# Altium project Sensor_Box_GPRS.PrjPCB
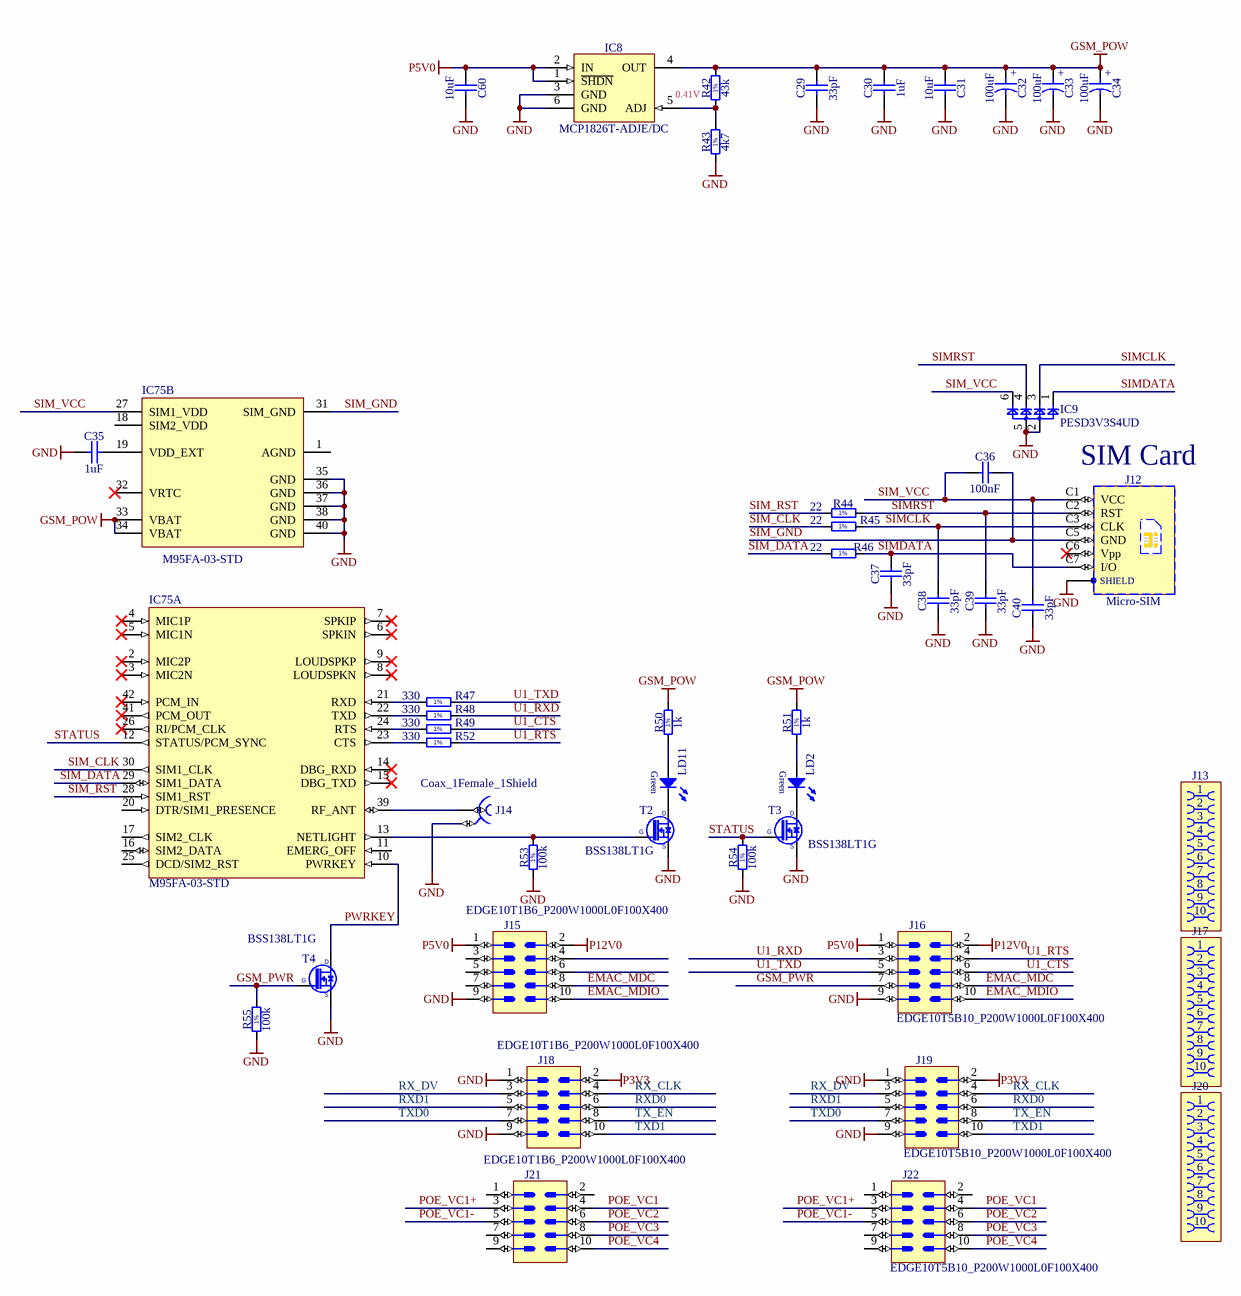
[diagram p0: Sensor_Box_GPRS.SchDoc]
1 sheet, 46 parts. Net scope: global (net labels, ports and power ports of the same name join across sheets).
Board file: Sensor_Box_GPRS.PCBDOC

## Sheet Sensor_Box_GPRS.SchDoc: Title
size 420 x 297 mm; Author: G.Kasprowicz; CompanyName: WUT ISE; DrawnBy: G.Kasprowicz; Organization: WUT ISE; Address1: PW ISE; Address2: Nowowiejska 15/19 00-665 Warsaw; Address3: gkasprow@gmail.com; Revision: 1.0; SheetNumber: -; SheetTotal: -; ModifiedBy: -; CheckedDate: -; Title2: Title2; DivGrp: WUT ISE; Designer: G.Kasprowicz; ModifiedDate: -; ProjectName: Sensor Box

### Parts
C29  33pF  [CAPC1005X55N]
C30  1uF  [CAPC1005X55N]
C31  10uF  [CAPC2012X135N]
C32  100uF  [CAPAE660X540N]
C33  100uF  [CAPAE660X540N]
C34  100uF  [CAPAE660X540N]
C35  1uF  [CAPC1005X55N]
C36  100nF  [CAPC1005X55N]
C37  33pF  [CAPC1005X55N]
C38  33pF  [CAPC1005X55N]
C39  33pF  [CAPC1005X55N]
C40  33pF  [CAPC1005X55N]
C60  10uF  [CAPC2012X135N]
IC8  MCP1826T-ADJE/DC  [SOT127P700X180-6N]
IC9  PESD3V3S4UD  [SOT457]
IC75  M95FA-03-STD  [QUEC-M95FA-03-STD_V]  (parts A,B of 2)
J12  Micro-SIM  [MOLEX_78800-0001]
J13  (no value)  [AVX_00 9159 010 061 916]
J14  Coax_1Female_1Shield  [NINIGI_MMCX-10]
J15  (no value)  [EDGE10T1B6_P200W1000L0F100X400]
J16  (no value)  [EDGE10T5B10_P200W1000L0F100X400]
J17  (no value)  [AVX_00 9159 010 061 916]
J18  (no value)  [EDGE10T1B6_P200W1000L0F100X400]
J19  (no value)  [EDGE10T5B10_P200W1000L0F100X400]
J20  (no value)  [AVX_00 9159 010 061 916]
J21  (no value)  [EDGE10T1B6_P200W1000L0F100X400]
J22  (no value)  [EDGE10T5B10_P200W1000L0F100X400]
LD2  Green  [LED_KINGBRIGHT_KPTR3216]  (value not drawn)
LD11  Green  [LED_KINGBRIGHT_KPTR3216]  (value not drawn)
R42  43k  [RESC1608X55N]
R43  4k7  [RESC1005X40N]
R44  22  [RESC1005X40N]
R45  22  [RESC1005X40N]
R46  22  [RESC1005X40N]
R47  330  [RESC1005X40N]
R48  330  [RESC1005X40N]
R49  330  [RESC1005X40N]
R50  1k  [RESC1005X40N]
R51  1k  [RESC1005X40N]
R52  330  [RESC1005X40N]
R53  100k  [RESC1005X40N]
R54  100k  [RESC1005X40N]
R55  100k  [RESC1005X40N]
T2  BSS138LT1G  [SOT95P240X110-3N]
T3  BSS138LT1G  [SOT95P240X110-3N]
T4  BSS138LT1G  [SOT95P240X110-3N]

### Nets
GND: C29.1 C30.1 C31.2 C32.2 C33.2 C34.2 C35.1 C37.1 C38.1 C39.1 C40.1 C60.2 IC8.3(GND) IC8.6(GND) IC9.2 IC9.5 IC75.35(GND) IC75.36(GND) IC75.37(GND) IC75.38(GND) IC75.40(GND) J12.SHIELD J14.2 J15.9 J16.9 J18.1 J18.9 J19.1 J19.9 R43.1 R53.1 R54.1 R55.1 T2.2(S) T3.2(S) T4.2(S)
GSM_POW: C29.2 C30.2 C31.1 C32.1 C33.1 C34.1 IC8.4(OUT) IC75.33(VBAT) IC75.34(VBAT) R42.2 R50.2 R51.2
P3V3: J18.2 J19.2
P5V0: C60.1 IC8.1(~{SHDN}) IC8.2(IN) J15.1 J16.1
P12V0: J15.2 J16.2
EMAC_MDC: J15.8 J16.8
EMAC_MDIO: J15.10 J16.10
GSM_PWR: J16.7 R55.2 T4.1(G)
POE_VC1: J21.4 J22.4
POE_VC1+: J21.3 J22.3
POE_VC1-: J21.5 J22.5
POE_VC2: J21.6 J22.6
POE_VC3: J21.8 J22.8
POE_VC4: J21.10 J22.10
PWRKEY: IC75.10(PWRKEY) T4.3(D)
RX_CLK: J18.4 J19.4
RX_DV: J18.3 J19.3
RXD0: J18.6 J19.6
RXD1: J18.5 J19.5
SIM_CLK: IC75.30(SIM1_CLK) R45.1
SIM_DATA: IC75.29(SIM1_DATA) R46.1
SIM_GND: C36.2 IC75.31(SIM_GND) J12.C5(GND)
SIM_RST: IC75.28(SIM1_RST) R44.1
SIM_VCC: C36.1 C40.2 IC9.6 IC75.27(SIM1_VDD) J12.C1(VCC)
SIMCLK: C38.2 IC9.3 J12.C3(CLK) R45.2
SIMDATA: C37.2 IC9.1 J12.C7(I/O) R46.2
SIMRST: C39.2 IC9.4 J12.C2(RST) R44.2
STATUS: IC75.12(STATUS/PCM_SYNC) R54.2 T3.1(G)
TX_EN: J18.8 J19.8
TXD0: J18.7 J19.7
TXD1: J18.10 J19.10
U1_CTS: J16.6 R49.2
U1_RTS: J16.4 R52.2
U1_RXD: J16.3 R48.2
U1_TXD: J16.5 R47.2
NetC35_2: C35.2 IC75.19(VDD_EXT)
NetIC8_5: IC8.5(ADJ) R42.1 R43.2
NetIC75_13: IC75.13(NETLIGHT) R53.2 T2.1(G)
NetIC75_21: IC75.21(RXD) R47.1
NetIC75_22: IC75.22(TXD) R48.1
NetIC75_23: IC75.23(CTS) R52.1
NetIC75_24: IC75.24(RTS) R49.1
NetIC75_39: IC75.39(RF_ANT) J14.1
NetLD2_1: LD2.1(C) T3.3(D)
NetLD2_2: LD2.2(A) R51.1
NetLD11_1: LD11.1(C) T2.3(D)
NetLD11_2: LD11.2(A) R50.1

Not connected (* = marked no-connect by the designer): IC75 1(AGND) 2(MIC2P)* 3(MIC2N)* 4(MIC1P)* 5(MIC1N)* 6(SPKIN)* 7(SPKIP)* 8(LOUDSPKN)* 9(LOUDSPKP)* 11(EMERG_OFF) 14(DBG_RXD)* 15(DBG_TXD)* 16(SIM2_DATA) 17(SIM2_CLK) 18(SIM2_VDD) 20(DTR/SIM1_PRESENCE) 25(DCD/SIM2_RST) 26(RI/PCM_CLK)* 32(VRTC)* 41(PCM_OUT)* 42(PCM_IN)*; J12 C6(Vpp)*; J15 3 4 5 6 7; J21 1 2 7 9; J22 1 2 7 9

### Notes on the sheet
- 0.41V
- SIM Card
- Project/Equipment
- Document
- Designer
- Drawn by
- Check.by
- Copyright WUT ISE 2018.
  This documentation describes Open Hardware and is licensed under the CERN OHL v.1.1. You may redistribute and modify this documentation under the terms of the CERN OHL v.1.1. (http://ohwr.org/CERNOHL). This documentation is distributed WITHOUT ANY EXPRESS OR IMPLIED WARRANTY, INCLUDING OF MERCHANTABILITY, SATISFACTORY QUALITY AND FITNESS FOR A PARTICULAR PURPOSE. Please see the CERN OHL v.1.1 for applicable conditions.
- Contact
- File
- Last Mod.
- Print Date
- Sheet
- Size
- A3
- of
- Rev
- (in symbol CAE660-540_100UF_16V_20%) +
- (in symbol R0402_1K_1%_0.0625W_100PPM) 1%
- (in symbol R0402_4K7_1%_0.0625W_100PPM) 1%
- (in symbol R0402_22R_1%_0.0625W_100PPM) 1%
- (in symbol R0402_100K_1%_0.0625W_100PPM) 1%
- (in symbol R0402_330R_1%_0.0625W_100PPM) 1%
- (in symbol R0603_43K_1%_0.1W_100PPM) 1%

### Library data of the parts
C29 C37-C40 = CC0402_33PF_50V_5%_C0G: Non-polarised capacitor; Part Description: SMD Multilayer Chip Ceramic Capacitor; Manufacturer: GENERIC; Manufacturer1 Part Number: C0402C330J5GACTU; Voltage: 50V; TC: C0G/NP0; Tolerance: ±5%; Part Number: CC0402_33PF_50V_5%_C0G; Component Kind: Standard; Component Type: Standard; Pin Count: 2; Value: 33pF; Status: Preferred; Manufacturer Part Number: CC0402_33PF_50V_5%_C0G; Case: 0402; Mounted: Yes; Socket: No; SMD: Yes; Sense: No; Manufacturer1 Example: KEMET; Manufacturer1 ComponentHeight: 0.55mm; HelpURL: \\cern.ch\dfs\Applications\Altium\Datasheets\CC0805_C0G_KEMET_(Commercial Grade).pdf; Author: CERN DEM JLC; CreateDate: 03.12.2007; LatestRevisionDate: 22.04.2015
C30 C35 = CC0402_1UF_16V_10%_X5R: Non-polarised capacitor; Part Description: SMD Multilayer Chip Ceramic Capacitor; Manufacturer: GENERIC; Manufacturer1 Part Number: C1005X5R1C105KT; Voltage: 16V; TC: X5R; Tolerance: ±10%; Part Number: CC0402_1UF_16V_10%_X5R; Component Kind: Standard; Component Type: Standard; Pin Count: 2; Value: 1uF; Status: Preferred; Manufacturer Part Number: CC0402_1UF_16V_10%_X5R; Case: 0402; Mounted: Yes; Socket: No; SMD: Yes; Sense: No; Manufacturer1 Example: TDK; Manufacturer1 ComponentHeight: 0.55mm; HelpURL: \\cern.ch\dfs\Applications\Altium\Datasheets\CC0402_X5R_TDK_C.pdf; Author: CERN DEM JLC; CreateDate: 25.10.2012; LatestRevisionDate: 25.10.2012
C31 C60 = CC0805_10UF_16V_10%_X5R: Non-polarised capacitor; Part Description: SMD Multilayer Chip Ceramic Capacitor; Manufacturer: GENERIC; Manufacturer1 Part Number: C0805C106K4PAC; Voltage: 16V; TC: X5R; Tolerance: ±10%; Part Number: CC0805_10UF_16V_10%_X5R; Component Kind: Standard; Component Type: Standard; Pin Count: 2; Value: 10uF; Status: Preferred; Manufacturer Part Number: CC0805_10UF_16V_10%_X5R; Case: 0805; Mounted: Yes; Socket: No; SMD: Yes; Manufacturer1 Example: KEMET; Manufacturer1 ComponentHeight: 1.4mm; HelpURL: \\cern.ch\dfs\Applications\Altium\Datasheets\CC1206_X5R_KEMET.pdf; Author: CERN DEM JLC; CreateDate: 03.12.2007; LatestRevisionDate: 03.12.2007; Sense: No
C32-C34 = CAE660-540_100UF_16V_20%: Polarised capacitor; Part Description: Aluminum Electrolytic SMT Capacitor; Manufacturer: PANASONIC; Manufacturer Part Number: EEEFK1C101AP; Voltage: 16V; Tolerance: ±20%; Part Number: CAE660-540_100UF_16V_20%; Component Kind: Standard; Component Type: Standard; Pin Count: 2; Value: 100uF; Status: Not Recommended; Case: D; Mounted: Yes; Socket: No; SMD: Yes; Sense: No; ComponentHeight: 5.8mm; HelpURL: \\cern.ch\dfs\Applications\Altium\Datasheets\CAE_PANASONIC_FK.pdf; Author: CERN DEM JLC; CreateDate: 03.12.2007; LatestRevisionDate: 05.11.2014
C36 = CC0402_100NF_16V_10%_X7R: Non-polarised capacitor; Part Description: SMD Multilayer Chip Ceramic Capacitor; Manufacturer: GENERIC; Manufacturer1 Part Number: GRM155R71C104KA88D; Voltage: 16V; TC: X7R; Tolerance: ±10%; Part Number: CC0402_100NF_16V_10%_X7R; Component Kind: Standard; Component Type: Standard; Pin Count: 2; Value: 100nF; Status: Not Recommended; Manufacturer Part Number: CC0402_100NF_16V_10%_X7R; Case: 0402; Mounted: Yes; Socket: No; SMD: Yes; Manufacturer1 Example: MURATA; Manufacturer1 ComponentHeight: 0.55mm; HelpURL: \\cern.ch\dfs\Applications\Altium\Datasheets\CC0402_X7R_MURATA_GRM.pdf; Author: CERN DEM JLC; CreateDate: 05.12.2013; LatestRevisionDate: 03.12.2007; Sense: No
IC8 = MCP1826T-ADJE/DC: 0.8V to 5.0V, 1A Low Voltage, Low Quiescent Current, Adjustable Positive LDO Regulator; Manufacturer: MICROCHIP TECHNOLOGY; PressFit: No; Bonding: No; Part Number: MCP1826T-ADJE/DC; Component Kind: Standard; Component Type: Standard; Device: MCP1826T-ADJE/DC; PackageDescription: SOT223, 6-Leads, Body 6.6x7.3mm (max), Pitch 1.27mm, IPC Medium Density; Part Description: 0.8V to 5.0V, 1A Low Voltage, Low Quiescent Current, Adjustable Positive LDO Regulator; Manufacturer Part Number: MCP1826T-ADJE/DC; Pin Count: 6; Case: SOT223; Mounted: Yes; Socket: No; SMD: Yes; Sense: No; ComponentHeight: 1.8mm; HelpURL: \\cern.ch\dfs\Applications\Altium\Datasheets\MCP1826T-ADJE-DC.pdf; Author: CERN DEM JLC; CreateDate: 03.10.2012; LatestRevisionDate: 03.10.2012
IC9 = D_TVS_PESD3V3S4UD: 3.3V TVS
IC75 = CMP-2000-06650-1: Quad-Band GSM / GPRS Module, 850 / 900 / 1800 / 1900 MHz, 3.3 to 4.6 V, -40 to 85 degC, 42-Pin SMD, RoHS, Tape and Reel; Manufacturer: QUECTELWIRELESSSOLUTIONS; Manufacturer URL: http://www.quectel.com/; Datasheet Version: Rev. 3.1, 11/2014; Package Reference: M95FA-03-STD; Package Description: 42-Pin Sourface Mount Device, Body 23.6 x 19.9 mm; Package: 42LCC; Category: RFModulesMisc; Mounting Technology: SurfaceMount; Operating Temperature: -40to85°C; Datasheet URL: https://www.codico.com/shop/media/datasheets/Quectel_M95_Hardware_Design_V3.1.pdf
J12 = MOLEX_78800-0001: 6 Contacts + Shield SIM Connector; Part Description: 1.50mm Height Hinged-style micro-SIM Card Socket Without Detect Switch, Surface Mount, 6 Circuits, Low-Halogen, Lead-Free; Manufacturer: MOLEX; PressFit: No; Part Number: MOLEX_78800-0001; Component Kind: Standard; Component Type: Standard; Pin Count: 6; Family: Micro-SIM; Mounted: Yes; Socket: No; SMD: Yes; Sense: No; Status: None; Manufacturer Part Number: 78800-0001; ComponentHeight: 1.6mm; HelpURL: \\cern.ch\dfs\Applications\Altium\Datasheets\MOLEX_78800-0001.pdf; Author: CERN DEM MR; CreateDate: 30.01.2018; LatestRevisionDate: 30.01.2018
J13 J17 J20 = AVX_00 9159 010 061 916: Open Ended Card Edge Connector, 9159 Series; Part Description: 10 Contacts, 2mm Pitch, Open Ended Card Edge Connector, 9159 Series; Manufacturer: AVX; PressFit: No; Part Number: AVX_00 9159 010 061 916; Component Kind: Standard; Component Type: Standard; Pin Count: 10; Mounted: Yes; Socket: No; SMD: No; Sense: No; Status: None; Manufacturer Part Number: 00 9159 010 061 916; ComponentHeight: 1.6mm; HelpURL: \\cern.ch\dfs\Applications\Altium\Datasheets\AVX_00 9159 010 061 916.pdf; Author: CERN DEM MR; CreateDate: 13.02.2018; LatestRevisionDate: 13.02.2018
J14 = CON_RF_MMCX: Part Number: MMCX-10; Part Description: Straight Through-hole 50 Ohm Micro Mini RF Jack, MMCX Series; Manufacturer: NINIGI; Manufacturer Part Number: NINIGI MMCX-10; PressFit: No; Component Kind: Standard; Component Type: Standard; Pin Count: 2; Mounted: Yes; Socket: No; Sense: No; SMD: No; Status: None; ComponentHeight: 4.35mm; HelpURL: \\cern.ch\dfs\Applications\Altium\Datasheets\SAMTEC_MMCX-J-P-H-ST-TH1.pdf; Author: GK; CreateDate: 05.12.2012; LatestRevisionDate: 05.12.2012
J15 J18 J21 = EDGE10T1B6_P200W1000L0F100X400: PCB Edge Connector 10 (2x5); Part Description: 10 Contacts Board Edge Connector, Pitch 2mm, Length 0mm, Width 10mm, Finger Lenght 4mm, Finger Width 1mm; Mounted: No; PressFit: No; Part Number: EDGE10T1B6_P200W1000L0F100X400; Component Kind: Standard (No BOM); Component Type: Standard (No BOM); Pin Count: 10; Socket: No; SMD: No; Sense: No; Status: None; ComponentHeight: 0mm; HelpURL: \\cern.ch\dfs\Applications\Altium\Datasheets\EDGE10T1B6_P200W1000L0F100X400.pdf; Author: CERN DEM MR; CreateDate: 14.02.2018; LatestRevisionDate: 14.02.2018
J16 J19 J22 = EDGE10T5B10_P200W1000L0F100X400: PCB Edge Connector 10 (2x5); Part Description: 10 Contacts Board Edge Connector, Pitch 2mm, Length 0mm, Width 10mm, Finger Lenght 4mm, Finger Width 1mm; Mounted: No; PressFit: No; Part Number: EDGE10T5B10_P200W1000L0F100X400; Component Kind: Standard (No BOM); Component Type: Standard (No BOM); Pin Count: 10; Socket: No; SMD: No; Sense: No; Status: None; ComponentHeight: 0mm; HelpURL: \\cern.ch\dfs\Applications\Altium\Datasheets\EDGE10T5B10_P200W1000L0F100X400.pdf; Author: CERN DEM MR; CreateDate: 14.02.2018; LatestRevisionDate: 14.02.2018
LD2 LD11 = LED_KINGBRIGHT_KPTR-3216CGCK: LED Green 1A 2C; Part Description: Reverse Mount LED 1.4x1.6mm Green; PressFit: No; Bonding: No; Part Number: LED_KINGBRIGHT_KPTR-3216CGCK; Component Kind: Standard; Component Type: Standard; Color: Green; PackageDescription: Reverse Mount LED 3216, Hole 2.1x2.3mm 0.35mm Height; Manufacturer: KINGBRIGHT; Manufacturer Part Number: KPTR-3216CGCK; Pin Count: 2; Mounted: Yes; Socket: No; SMD: Yes; Sense: No; ComponentHeight: 0.35mm; HelpURL: \\cern.ch\dfs\Applications\Altium\Datasheets\LED_KINGBRIGHT_KPTR-3216CGCK.pdf; Author: CERN DEM MR; CreateDate: 15.02.2016; LatestRevisionDate: 15.02.2016
R42 = R0603_43K_1%_0.1W_100PPM: Resistor - 1%; Part Description: General Purpose Thick Film Chip Resistor; Manufacturer: GENERIC; Manufacturer1 Part Number: NRC06F4302TRF; Power: 0.1W; TC: ±100ppm/°C; PressFit: No; Part Number: R0603_43K_1%_0.1W_100PPM; Component Kind: Standard; Component Type: Standard; Pin Count: 2; Value: 43k; Status: Preferred; Tolerance: ±1%; Manufacturer Part Number: R0603_43K_1%_0.1W_100PPM; Case: 0603; Mounted: Yes; Sense: No; Socket: No; SMD: Yes; Manufacturer1 Example: NIC COMPONENT; Manufacturer1 ComponentHeight: 0.55mm; HelpURL: \\cern.ch\dfs\Applications\Altium\Datasheets\R0603_NIC_NRC.pdf; Author: CERN DEM JLC; CreateDate: 03.12.2007; LatestRevisionDate: 13.03.2008
R43 = R0402_4K7_1%_0.0625W_100PPM: Resistor - 1%; Part Description: General Purpose Thick Film Chip Resistor; Manufacturer: GENERIC; Manufacturer1 Part Number: 232270674702L; TC: ±100ppm/°C; PressFit: No; Part Number: R0402_4K7_1%_0.0625W_100PPM; Component Kind: Standard; Component Type: Standard; Pin Count: 2; Value: 4k7; Status: Not Recommended; Power: 0.0625W; Tolerance: ±1%; Manufacturer Part Number: R0402_4K7_1%_0.0625W_100PPM; Case: 0402; Mounted: Yes; Sense: No; Socket: No; SMD: Yes; Manufacturer1 Example: YAGEO PHYCOMP; Manufacturer1 ComponentHeight: 0.4mm; HelpURL: \\cern.ch\dfs\Applications\Altium\Datasheets\R0402_Phycomp_RC0402.pdf; Author: CERN DEM JLC; CreateDate: 03.12.2007; LatestRevisionDate: 17.10.2012
R44-R46 = R0402_22R_1%_0.0625W_100PPM: Resistor - 1%; Part Description: General Purpose Thick Film Chip Resistor; Manufacturer: GENERIC; Manufacturer1 Part Number: 232270672209L; TC: ±100ppm/°C; PressFit: No; Part Number: R0402_22R_1%_0.0625W_100PPM; Component Kind: Standard; Component Type: Standard; Pin Count: 2; Value: 22; Status: Not Recommended; Power: 0.0625W; Tolerance: ±1%; Manufacturer Part Number: R0402_22R_1%_0.0625W_100PPM; Case: 0402; Mounted: Yes; Sense: No; Socket: No; SMD: Yes; Manufacturer1 Example: YAGEO PHYCOMP; Manufacturer1 ComponentHeight: 0.4mm; HelpURL: \\cern.ch\dfs\Applications\Altium\Datasheets\R0402_Phycomp_RC0402.pdf; Author: CERN DEM JLC; CreateDate: 03.12.2007; LatestRevisionDate: 17.10.2012
R47-R49 R52 = R0402_330R_1%_0.0625W_100PPM: Resistor - 1%; Part Description: General Purpose Thick Film Chip Resistor; Manufacturer: GENERIC; Manufacturer1 Part Number: 232270673301L; TC: ±100ppm/°C; PressFit: No; Part Number: R0402_330R_1%_0.0625W_100PPM; Component Kind: Standard; Component Type: Standard; Pin Count: 2; Value: 330; Status: Not Recommended; Power: 0.0625W; Tolerance: ±1%; Manufacturer Part Number: R0402_330R_1%_0.0625W_100PPM; Case: 0402; Mounted: Yes; Sense: No; Socket: No; SMD: Yes; Manufacturer1 Example: YAGEO PHYCOMP; Manufacturer1 ComponentHeight: 0.4mm; HelpURL: \\cern.ch\dfs\Applications\Altium\Datasheets\R0402_Phycomp_RC0402.pdf; Author: CERN DEM JLC; CreateDate: 03.12.2007; LatestRevisionDate: 17.10.2012
R50 R51 = R0402_1K_1%_0.0625W_100PPM: Resistor - 1%; Part Description: General Purpose Thick Film Chip Resistor; Manufacturer: GENERIC; Manufacturer1 Part Number: 232270671002L; TC: ±100ppm/°C; PressFit: No; Part Number: R0402_1K_1%_0.0625W_100PPM; Component Kind: Standard; Component Type: Standard; Pin Count: 2; Value: 1k; Status: Not Recommended; Power: 0.0625W; Tolerance: ±1%; Manufacturer Part Number: R0402_1K_1%_0.0625W_100PPM; Case: 0402; Mounted: Yes; Sense: No; Socket: No; SMD: Yes; Manufacturer1 Example: YAGEO PHYCOMP; Manufacturer1 ComponentHeight: 0.4mm; HelpURL: \\cern.ch\dfs\Applications\Altium\Datasheets\R0402_Phycomp_RC0402.pdf; Author: CERN DEM JLC; CreateDate: 03.12.2007; LatestRevisionDate: 17.10.2012
R53-R55 = R0402_100K_1%_0.0625W_100PPM: Resistor - 1%; Part Description: General Purpose Thick Film Chip Resistor; Manufacturer: GENERIC; Manufacturer1 Part Number: 232270671004L; TC: ±100ppm/°C; PressFit: No; Part Number: R0402_100K_1%_0.0625W_100PPM; Component Kind: Standard; Component Type: Standard; Pin Count: 2; Value: 100k; Status: Not Recommended; Power: 0.0625W; Tolerance: ±1%; Manufacturer Part Number: R0402_100K_1%_0.0625W_100PPM; Case: 0402; Mounted: Yes; Sense: No; Socket: No; SMD: Yes; Manufacturer1 Example: YAGEO PHYCOMP; Manufacturer1 ComponentHeight: 0.4mm; HelpURL: \\cern.ch\dfs\Applications\Altium\Datasheets\R0402_Phycomp_RC0402.pdf; Author: CERN DEM JLC; CreateDate: 03.12.2007; LatestRevisionDate: 17.10.2012
T2-T4 = BSS138LT1G: N-CHANNEL MOSFET WITH DIODE; Part Description: 50V 200mA N-Channel Enhancement Mode Field-Effect Transistor; Manufacturer: ON SEMICONDUCTOR; PressFit: No; Bonding: No; Part Number: BSS138LT1G; Component Kind: Standard; Component Type: Standard; Device: BSS138LT1G; PackageDescription: SOT23 3-Leads, Pitch 0.95mm - Body 1.4x3mm, IPC Medium Density; Manufacturer Part Number: BSS138LT1G; Pin Count: 3; Case: SOT23-3; Mounted: Yes; Socket: No; SMD: Yes; Sense: No; ComponentHeight: 1.11mm; HelpURL: \\cern.ch\dfs\Applications\Altium\Datasheets\BSS138LT1G.pdf; Author: CERN DEM JLC; CreateDate: 23.03.2009; LatestRevisionDate: 23.03.2009